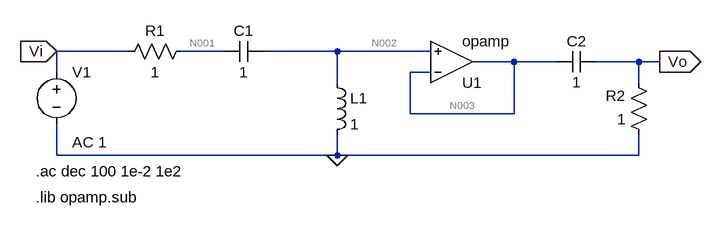
[diagram p0: schematic TS4.asc]
TS4.asc, the LTspice schematic file:
Version 4
SHEET 1 940 680
WIRE -128 48 -240 48
WIRE 16 48 -48 48
WIRE 192 48 80 48
WIRE 336 48 192 48
WIRE 464 64 400 64
WIRE 528 64 464 64
WIRE 656 64 592 64
WIRE 688 64 656 64
WIRE -240 80 -240 48
WIRE 336 80 304 80
WIRE 192 96 192 48
WIRE 656 96 656 64
WIRE 304 144 304 80
WIRE 464 144 464 64
WIRE 464 144 304 144
WIRE -240 208 -240 160
WIRE 192 208 192 176
WIRE 192 208 -240 208
WIRE 656 208 656 176
WIRE 656 208 192 208
FLAG 192 208 0
FLAG -240 48 Vi
IOPIN -240 48 In
FLAG 688 64 Vo
IOPIN 688 64 Out
SYMBOL res -32 32 R90
WINDOW 0 0 56 VBottom 2
WINDOW 3 32 56 VTop 2
SYMATTR InstName R1
SYMATTR Value 1
SYMBOL voltage -240 64 R0
WINDOW 123 24 124 Left 2
WINDOW 39 0 0 Left 2
SYMATTR Value2 AC 1
SYMATTR InstName V1
SYMATTR Value ""
SYMBOL Opamps\\opamp 368 128 M180
SYMATTR InstName U1
SYMBOL res 672 192 R180
WINDOW 0 36 76 Left 2
WINDOW 3 36 40 Left 2
SYMATTR InstName R2
SYMATTR Value 1
SYMBOL ind 176 80 R0
SYMATTR InstName L1
SYMATTR Value 1
SYMBOL cap 80 32 R90
WINDOW 0 0 32 VBottom 2
WINDOW 3 32 32 VTop 2
SYMATTR InstName C1
SYMATTR Value 1
SYMBOL cap 528 80 R270
WINDOW 0 32 32 VTop 2
WINDOW 3 0 32 VBottom 2
SYMATTR InstName C2
SYMATTR Value 1
TEXT -272 232 Left 2 !.ac dec 100 1e-2 1e2
TEXT -272 272 Left 2 !.lib opamp.sub

The netlist it stands for:
* TS4.asc
R1 N001 Vi 1
V1 Vi 0 AC 1
XU1 N003 N002 N003 opamp Aol=100K GBW=10Meg  ; pins invin noninvin out
R2 0 Vo 1
L1 N002 0 1
C1 N002 N001 1
C2 N003 Vo 1
.ac dec 100 1e-2 1e2
.lib opamp.sub
.backanno
.end

* Results of the author's LTspice run, read from the files saved beside the schematic
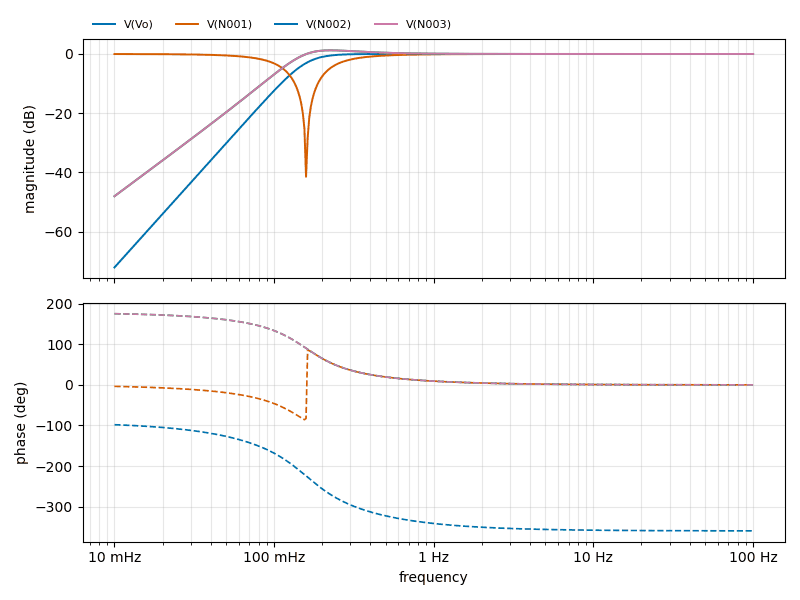
[diagram p1: AC Analysis of TS4.asc, plotted from the saved traces]
* AC Analysis, 1 run:
*   V(Vo): -72.11 dB at 10 mHz, -0.00 dB at 100 Hz, peak -0.00 dB at 100 Hz, 3 dB below the peak at 159.3 mHz
*   V(N001): -0.02 dB at 10 mHz, -0.00 dB at 100 Hz, peak -0.00 dB at 100 Hz, 3 dB below the peak at 257.7 mHz
*   V(N002): -48.05 dB at 10 mHz, 0.00 dB at 100 Hz, peak 1.24 dB at 223.9 mHz, 3 dB below the peak at 136.2 mHz
*   V(N003): -48.05 dB at 10 mHz, -0.00 dB at 100 Hz, peak 1.24 dB at 223.9 mHz, 3 dB below the peak at 136.2 mHz